# EAGLE schematic 4 ch sample-and-hold without mux v1.1 (EAGLE 9.6.2)
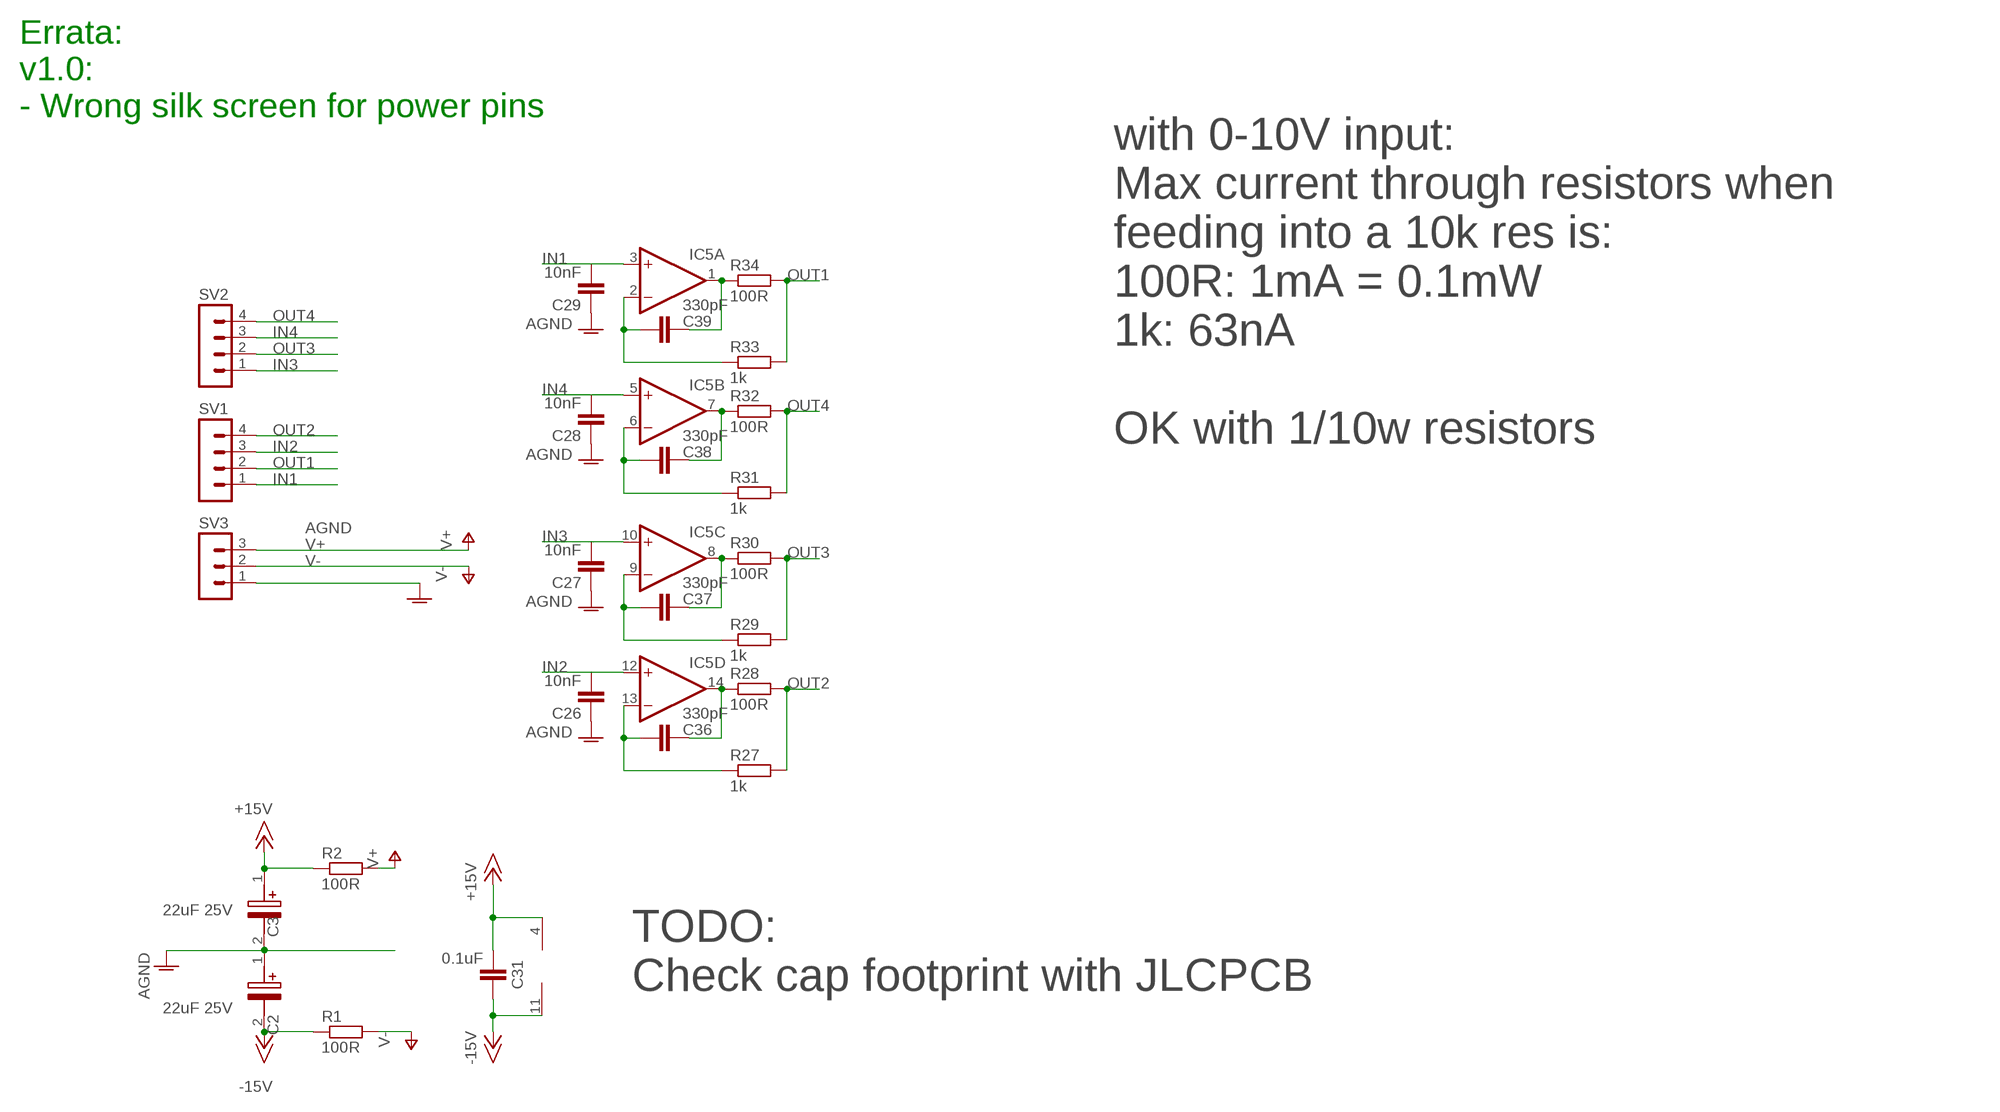
[diagram p0: schematic, sheet 1]

## Parts
C2  22uF 25V  VZL101M1CTR-0606  [CAPAE660X610N]
C3  22uF 25V  VZL101M1CTR-0606  [CAPAE660X610N]
C26  10nF  C-EUC0805  [C0805]
C27  10nF  C-EUC0805  [C0805]
C28  10nF  C-EUC0805  [C0805]
C29  10nF  C-EUC0805  [C0805]
C31  0.1uF  C-EUC0603  [C0603]
C36  330pF  C-EUC0603  [C0603]
C37  330pF  C-EUC0603  [C0603]
C38  330pF  C-EUC0603  [C0603]
C39  330pF  C-EUC0603  [C0603]
IC5  TL074D  [SO14]
R1  100R  R-EU_R0805  [R0805]
R2  100R  R-EU_R0805  [R0805]
R27  1k  R-EU_R0603  [R0603]
R28  100R  R-EU_R0603  [R0603]
R29  1k  R-EU_R0603  [R0603]
R30  100R  R-EU_R0603  [R0603]
R31  1k  R-EU_R0603  [R0603]
R32  100R  R-EU_R0603  [R0603]
R33  1k  R-EU_R0603  [R0603]
R34  100R  R-EU_R0603  [R0603]
SV1  MA04-1JP  [SIP-PIN04-1J]
SV2  MA04-1JP  [SIP-PIN04-1J]
SV3  MA03-1JP  [SIP-PIN03-1J]

## Nets
+15V: C3.1(+) C31.1 IC5.4(P:V+) R2.1
-15V: C2.2(-) C31.2 IC5.11(P:V-) R1.1
AGND: C2.1(+) C3.2(-) C26.1 C27.1 C28.1 C29.1 SV3.1
IN1: C29.2 IC5.3(A:+IN) SV1.1
IN2: C26.2 IC5.12(D:+IN) SV1.3
IN3: C27.2 IC5.10(C:+IN) SV2.1
IN4: C28.2 IC5.5(B:+IN) SV2.3
N$33: C39.1 IC5.1(A:OUT) R34.1
N$34: C39.2 IC5.2(A:-IN) R33.1
N$35: C38.1 IC5.7(B:OUT) R32.1
N$36: C38.2 IC5.6(B:-IN) R31.1
N$37: C37.1 IC5.8(C:OUT) R30.1
N$38: C36.1 IC5.14(D:OUT) R28.1
N$39: C37.2 IC5.9(C:-IN) R29.1
N$40: C36.2 IC5.13(D:-IN) R27.1
OUT1: R33.2 R34.2 SV1.2
OUT2: R27.2 R28.2 SV1.4
OUT3: R29.2 R30.2 SV2.2
OUT4: R31.2 R32.2 SV2.4
V+: R2.2 SV3.3
V-: R1.2 SV3.2

## Notes on the sheet
- Errata:
  v1.0:
  - Wrong silk screen for power pins
- with 0-10V input:
  Max current through resistors when
  feeding into a 10k res is:
  100R: 1mA = 0.1mW
  1k: 63nA
  
  OK with 1/10w resistors
- TODO: 
  Check cap footprint with JLCPCB

## Library data of the parts
C2 C3 = joakim-jclpcb:VZL101M1CTR-0606: Aluminum Electrolytic Capacitors - SMD 100uF 16 Volts 20% Source: Datasheet <https://www.mouser.com/datasheet/2/231/151002386372-1222327.pdf>; DESCRIPTION: Aluminum Electrolytic Capacitors - SMD 100uF 16 Volts 20%; HEIGHT: 6.1mm; MANUFACTURER_NAME: Lelon; MANUFACTURER_PART_NUMBER: VZL101M1CTR-0606; MOUSER_PART_NUMBER: 140-VZL101M1CTR-0606; MOUSER_PRICE-STOCK: https://www.mouser.com/Search/Refine.aspx?Keyword=140-VZL101M1CTR-0606
C26-C29 = rcl:C-EU: CAPACITOR, European symbol; SPICEPREFIX: C
C31 C36-C39 = resistor:C-EU: CAPACITOR, European symbol
IC5 = linear:TL074: OP AMP
R1 R2 = rcl:R-EU_: RESISTOR, European symbol; SPICEPREFIX: R
R27-R34 = resistor:R-EU_: RESISTOR, European symbol
SV1 SV2 = joakim:MA04-1J: PIN HEADER
SV3 = joakim:MA03-1J: PIN HEADER